# Altium schematic sheet Temp_sensor.SchDoc
size A; SheetNumber: 5; SheetTotal: 5
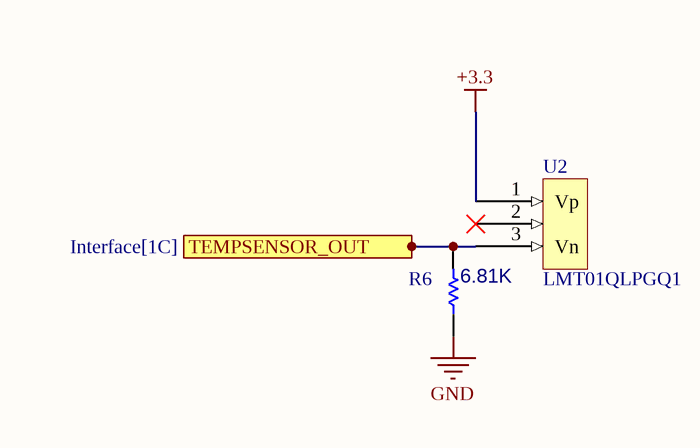
[diagram p0: Temp_sensor.SchDoc]

## Parts
R6  value 6.81K  [R0603A]  (hidden comment: Resistor)
U2  LMT01QLPGQ1  [LMT01-Q1]

## Ports
TEMPSENSOR_OUT (out, see Interface[1C])

## Nets
+3.3: U2.1(Vp)
GND: R6.1
TEMPSENSOR_OUT: R6.2 U2.3(Vn) ; port TEMPSENSOR_OUT

Not connected (* = marked no-connect by the designer): U2 2*

## Library data of the parts
R6 = CMP-009-00002-14
U2 = CMP-010-00023-4: Serial Switch/Digital Sensor, 13 Bit(s), 0.75Cel, Rectangular, Through Hole Mount; Max Supply Voltage: 5.5V; Sensor Type: TEMPERATURE SENSOR,SWITCH/DIGITAL OUTPUT,SERIAL; Min Supply Voltage: 2V; Min Operating Temperature: -40°C; Max Operating Temperature: 125°C; Mounting Technology: Through Hole; Datasheet: https://www.ti.com/lit/ds/symlink/lmt01-q1.pdf?HQS=dis-dk-null-digikeymode-dsf-pf-null-wwe&ts=1697411055213&ref_url=https%253A%252F%252Fwww.ti.com%252Fgeneral%252Fdocs%252Fsuppproductinfo.tsp%253FdistId%253D10%2526gotoUrl%253Dhttps%253A%252F%252Fwww.ti.com%252Flit%252Fgpn%252Flmt01-q1; RoHS Compliant: Yes